# Altium schematic sheet 2-N Mos.schdoc
size 127 x 101 mm
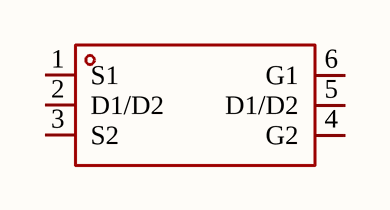
[diagram p0: 2-N Mos.schdoc]

## Parts
Q?  FS8205A  [SOT-23-6_L2.9-W1.6-P0.95-LS2.8-BR]  (value not drawn)

## Nets

Not connected (* = marked no-connect by the designer): Q? 1(S1) 2(D1/D2) 3(S2) 4(G2) 5(D1/D2) 6(G1)

## Library data of the parts
Q? = FS8205A_C2830320: Manufacturer: TECH PUBLIC(台舟); Add into BOM: yes; Type: 2 N-Channel; Drain Source On Resistance (RDS(on)@Vgs,Id): 19.5mΩ@4.5V,3A; Gate Threshold Voltage (Vgs(th)@Id): 700mV@250uA; Total Gate Charge (Qg@Vgs): 5.7nC@10V; Input Capacitance (Ciss@Vds): 466pF@10V; Reverse Transfer Capacitance (Crss@Vds): 58pF@10V; Symbol: FS8205A_C2830320; Device: FS8205A_C2830320; LCSC Part Name: 2个N沟道 耐压:20V 电流:6A; Supplier Part: C2830320; Manufacturer Part: FS8205A; Supplier Footprint: SOT-23-6; JLCPCB Part Class: Extended Part; Datasheet: https://atta.szlcsc.com/upload/public/pdf/source/20210810/F53B6D4E8755A1F8E11BAF814CE98E6A.pdf; Supplier: LCSC; Convert to PCB: yes; Operating Temperature: -55℃~+150℃@(Tj)